# Altium schematic sheet 09_FPGA_E.SchDoc: FPGA Part E: System / Power
size 381 x 266 mm; Organization: Meteroi; Address1: Room 428, 410 Guiping Rd.; Address2: Shanghai 200233, CHINA; SheetNumber: 10; SheetTotal: 11; PageSetup: Record=PageOptions|CenterHorizontal=True|CenterVertical=True|PrintScale=0.75|XCorrection=1.00|YCorrection=1.00|PrintKind=2|BorderSize=5000000|LeftOffset=0|BottomOffset=0|Orientation=2|PaperLength=1000|PaperWidth=1000|Scale=100|PaperSource=276|PrintQuality=-3|MediaType=1|DitherType=10|PaperKind=A4|PrintScaleMode=1
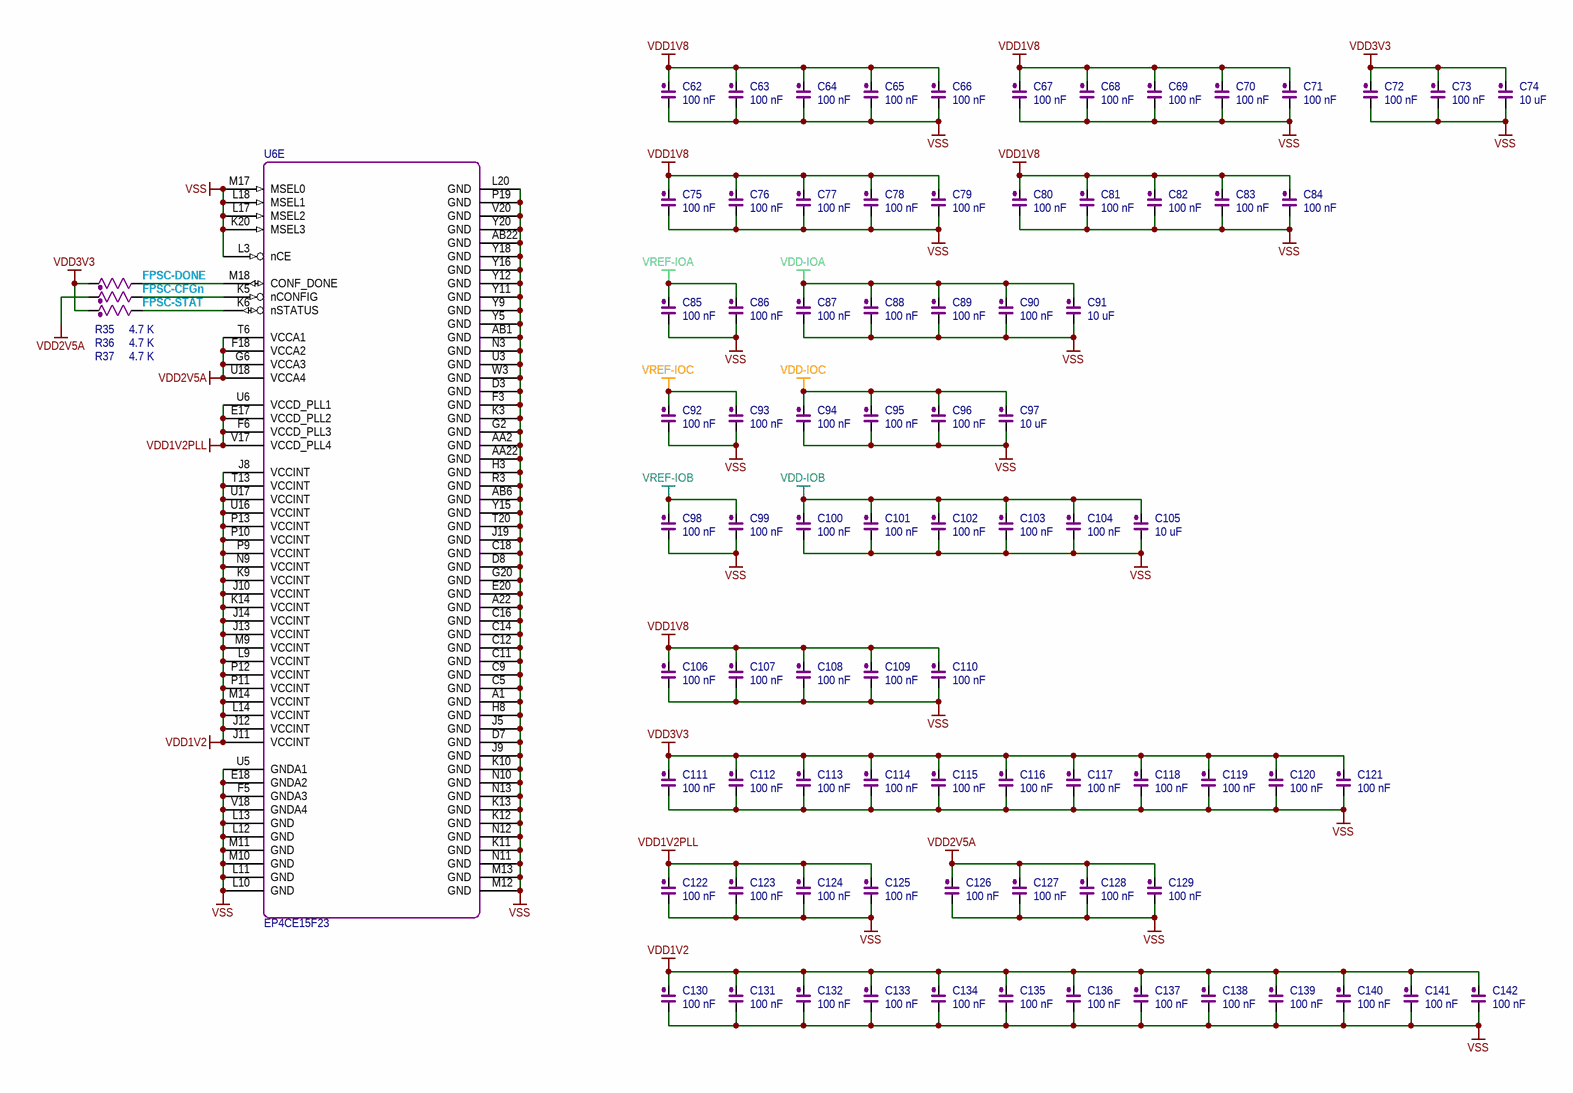
[diagram p0: 09_FPGA_E.SchDoc]

## Parts
C62  100 nF  [0402A1]
C63  100 nF  [0402A1]
C64  100 nF  [0402A1]
C65  100 nF  [0402A1]
C66  100 nF  [0402A1]
C67  100 nF  [0402A1]
C68  100 nF  [0402A1]
C69  100 nF  [0402A1]
C70  100 nF  [0402A1]
C71  100 nF  [0402A1]
C72  100 nF  [0402A1]
C73  100 nF  [0402A1]
C74  10 uF  [0603A1]
C75  100 nF  [0402A1]
C76  100 nF  [0402A1]
C77  100 nF  [0402A1]
C78  100 nF  [0402A1]
C79  100 nF  [0402A1]
C80  100 nF  [0402A1]
C81  100 nF  [0402A1]
C82  100 nF  [0402A1]
C83  100 nF  [0402A1]
C84  100 nF  [0402A1]
C85  100 nF  [0402A1]
C86  100 nF  [0402A1]
C87  100 nF  [0402A1]
C88  100 nF  [0402A1]
C89  100 nF  [0402A1]
C90  100 nF  [0402A1]
C91  10 uF  [0603A1]
C92  100 nF  [0402A1]
C93  100 nF  [0402A1]
C94  100 nF  [0402A1]
C95  100 nF  [0402A1]
C96  100 nF  [0402A1]
C97  10 uF  [0603A1]
C98  100 nF  [0402A1]
C99  100 nF  [0402A1]
C100  100 nF  [0402A1]
C101  100 nF  [0402A1]
C102  100 nF  [0402A1]
C103  100 nF  [0402BG]
C104  100 nF  [0402BG]
C105  10 uF  [0603A1]
C106  100 nF  [0402BG]
C107  100 nF  [0402BG]
C108  100 nF  [0402BG]
C109  100 nF  [0402BG]
C110  100 nF  [0402BG]
C111  100 nF  [0402BG]
C112  100 nF  [0402BG]
C113  100 nF  [0402BG]
C114  100 nF  [0402BG]
C115  100 nF  [0402BG]
C116  100 nF  [0402BG]
C117  100 nF  [0402BG]
C118  100 nF  [0402BG]
C119  100 nF  [0402BG]
C120  100 nF  [0402BG]
C121  100 nF  [0402BG]
C122  100 nF  [0402BG]
C123  100 nF  [0402BG]
C124  100 nF  [0402BG]
C125  100 nF  [0402BG]
C126  100 nF  [0402BG]
C127  100 nF  [0402BG]
C128  100 nF  [0402BG]
C129  100 nF  [0402BG]
C130  100 nF  [0402BG]
C131  100 nF  [0402BG]
C132  100 nF  [0402BG]
C133  100 nF  [0402BG]
C134  100 nF  [0402BG]
C135  100 nF  [0402BG]
C136  100 nF  [0402BG]
C137  100 nF  [0402BG]
C138  100 nF  [0402BG]
C139  100 nF  [0402BG]
C140  100 nF  [0402BG]
C141  100 nF  [0402BG]
C142  100 nF  [0402BG]
R35  4.7 K  [0402A2]
R36  4.7 K  [0402A2]
R37  4.7 K  [0402A2]
U6  EP4CE15F23  [FBGA-484]  (part E of 5)

## Nets
VDD1V2: C130.2 C131.2 C132.2 C133.2 C134.2 C135.2 C136.2 C137.2 C138.2 C139.2 C140.2 C141.2 C142.2 U6.J8(VCCINT) U6.J10(VCCINT) U6.J11(VCCINT) U6.J12(VCCINT) U6.J13(VCCINT) U6.J14(VCCINT) U6.K9(VCCINT) U6.K14(VCCINT) U6.L9(VCCINT) U6.L14(VCCINT) U6.M9(VCCINT) U6.M14(VCCINT) U6.N9(VCCINT) U6.P9(VCCINT) U6.P10(VCCINT) U6.P11(VCCINT) U6.P12(VCCINT) U6.P13(VCCINT) U6.T13(VCCINT) U6.U16(VCCINT) U6.U17(VCCINT)
VDD1V2PLL: C122.2 C123.2 C124.2 C125.2 U6.E17(VCCD_PLL2) U6.F6(VCCD_PLL3) U6.U6(VCCD_PLL1) U6.V17(VCCD_PLL4)
VDD1V8: C62.2 C63.2 C64.2 C65.2 C66.2 C67.2 C68.2 C69.2 C70.2 C71.2 C75.2 C76.2 C77.2 C78.2 C79.2 C80.2 C81.2 C82.2 C83.2 C84.2 C106.2 C107.2 C108.2 C109.2 C110.2
VDD2V5A: C126.2 C127.2 C128.2 C129.2 R36.2 U6.F18(VCCA2) U6.G6(VCCA3) U6.T6(VCCA1) U6.U18(VCCA4)
VDD3V3: C72.2 C73.2 C74.2 C111.2 C112.2 C113.2 C114.2 C115.2 C116.2 C117.2 C118.2 C119.2 C120.2 C121.2 R35.2 R37.2
VDD-IOA: C87.2 C88.2 C89.2 C90.2 C91.2
VDD-IOB: C100.2 C101.2 C102.2 C103.2 C104.2 C105.2
VDD-IOC: C94.2 C95.2 C96.2 C97.2
VREF-IOA: C85.2 C86.2
VREF-IOB: C98.2 C99.2
VREF-IOC: C92.2 C93.2
VSS: C62.1 C63.1 C64.1 C65.1 C66.1 C67.1 C68.1 C69.1 C70.1 C71.1 C72.1 C73.1 C74.1 C75.1 C76.1 C77.1 C78.1 C79.1 C80.1 C81.1 C82.1 C83.1 C84.1 C85.1 C86.1 C87.1 C88.1 C89.1 C90.1 C91.1 C92.1 C93.1 C94.1 C95.1 C96.1 C97.1 C98.1 C99.1 C100.1 C101.1 C102.1 C103.1 C104.1 C105.1 C106.1 C107.1 C108.1 C109.1 C110.1 C111.1 C112.1 C113.1 C114.1 C115.1 C116.1 C117.1 C118.1 C119.1 C120.1 C121.1 C122.1 C123.1 C124.1 C125.1 C126.1 C127.1 C128.1 C129.1 C130.1 C131.1 C132.1 C133.1 C134.1 C135.1 C136.1 C137.1 C138.1 C139.1 C140.1 C141.1 C142.1 U6.A1(GND) U6.A22(GND) U6.AA2(GND) U6.AA22(GND) U6.AB1(GND) U6.AB6(GND) U6.AB22(GND) U6.C5(GND) U6.C9(GND) U6.C11(GND) U6.C12(GND) U6.C14(GND) U6.C16(GND) U6.C18(GND) U6.D3(GND) U6.D7(GND) U6.D8(GND) U6.E18(GNDA2) U6.E20(GND) U6.F3(GND) U6.F5(GNDA3) U6.G2(GND) U6.G20(GND) U6.H3(GND) U6.H8(GND) U6.J5(GND) U6.J9(GND) U6.J19(GND) U6.K3(GND) U6.K10(GND) U6.K11(GND) U6.K12(GND) U6.K13(GND) U6.K20(MSEL3) U6.L3(nCE) U6.L10(GND) U6.L11(GND) U6.L12(GND) U6.L13(GND) U6.L17(MSEL2) U6.L18(MSEL1) U6.L20(GND) U6.M10(GND) U6.M11(GND) U6.M12(GND) U6.M13(GND) U6.M17(MSEL0) U6.N3(GND) U6.N10(GND) U6.N11(GND) U6.N12(GND) U6.N13(GND) U6.P19(GND) U6.R3(GND) U6.T20(GND) U6.U3(GND) U6.U5(GNDA1) U6.V18(GNDA4) U6.V20(GND) U6.W3(GND) U6.Y5(GND) U6.Y9(GND) U6.Y11(GND) U6.Y12(GND) U6.Y15(GND) U6.Y16(GND) U6.Y18(GND) U6.Y20(GND)
FPSC-CFGn: R36.1 U6.K5(nCONFIG)
FPSC-DONE: R35.1 U6.M18(CONF_DONE)
FPSC-STAT: R37.1 U6.K6(nSTATUS)

## Notes on the sheet
- Title:
- Project:
- Sheet:
- Of
- Size:
- D/N:
- Rev:
- Date:
- P/N:
- S/N:
- Designer:
- C

## Library data of the parts
C62-C142 = CAP: Normal Capacitor; PartNumber: 0; Vendor: muRata; Designer: shyul; PinCountSMD: 2; SerialNumber: 0; Publisher: Cowin; PCBMarker: Capacitor; Version: 1.0; VersionDate: 04-27-2011; PinCountHole: 0
  C62-C73 C75-C90 C92-C96 C98-C104 C106-C142: Value: 100 nF
  C74 C91 C97 C105: Value: 10 uF
R35-R37 = RES: Normal Resistor; PartNumber: 0; Vendor: KOA; Designer: shyul; PinCountSMD: 2; SerialNumber: 0; Value: 4.7 K; Version: 1.0; VersionDate: 04-27-2011; PCBMarker: Resistor; Publisher: Cowin; PinCountHole: 0
U6 = EP4CE15F23: Cyclone IV EP4CE15F23 FPGA; PartNumber: EP4CE15F23C8N; SerialNumber: 0; Vendor: Altera; Designer: shyul; PCBMarker: FPGA; Version: 1.0; VersionDate: 2-17-2012; Value: EP4CE15F23; Publisher: Cowin